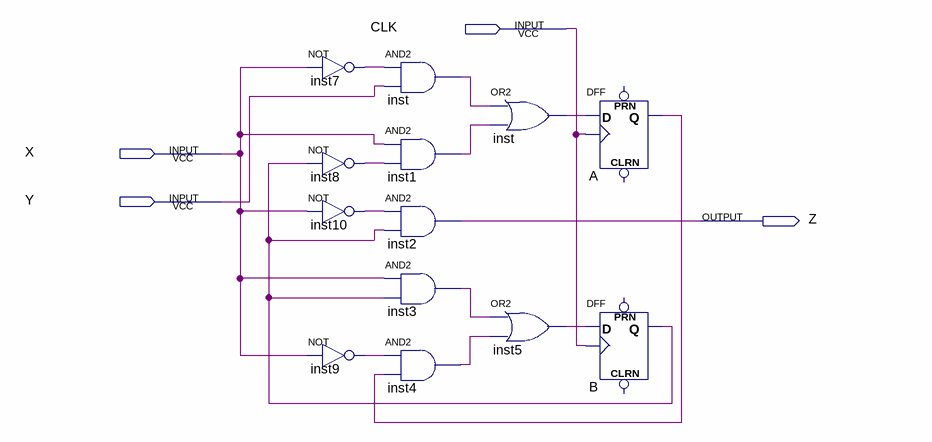
[diagram p0: schematic sheet]
// Quartus schematic hw10p4a.bdf as structural Verilog: 13 symbols, 4 pins
module hw10p4a (
  input  CLK,
  input  X,
  input  Y,
  output Z
);

  wire A_q, B_q, inst1_out, inst3_out, inst4_out, inst5_out, inst7_out, inst8_out, inst9_out, inst10_out,
       inst_out, inst_out_2;

  not inst7 (inst7_out, X);
  not inst8 (inst8_out, B_q);
  not inst10 (inst10_out, X);
  not inst9 (inst9_out, X);
  and inst (inst_out, inst7_out, Y);
  and inst1 (inst1_out, X, inst8_out);
  and inst2 (Z, inst10_out, B_q);
  and inst3 (inst3_out, X, B_q);
  and inst4 (inst4_out, inst9_out, A_q);
  or inst_dup2 (inst_out_2, inst_out, inst1_out);
  or inst5 (inst5_out, inst3_out, inst4_out);
  DFF A (.CLK(CLK), .D(inst_out_2), .Q(A_q));  // open: CLRN, PRN
  DFF B (.CLK(CLK), .D(inst5_out), .Q(B_q));  // open: CLRN, PRN
endmodule
